# EAGLE schematic ChessMateBattery (EAGLE 9.1.0)
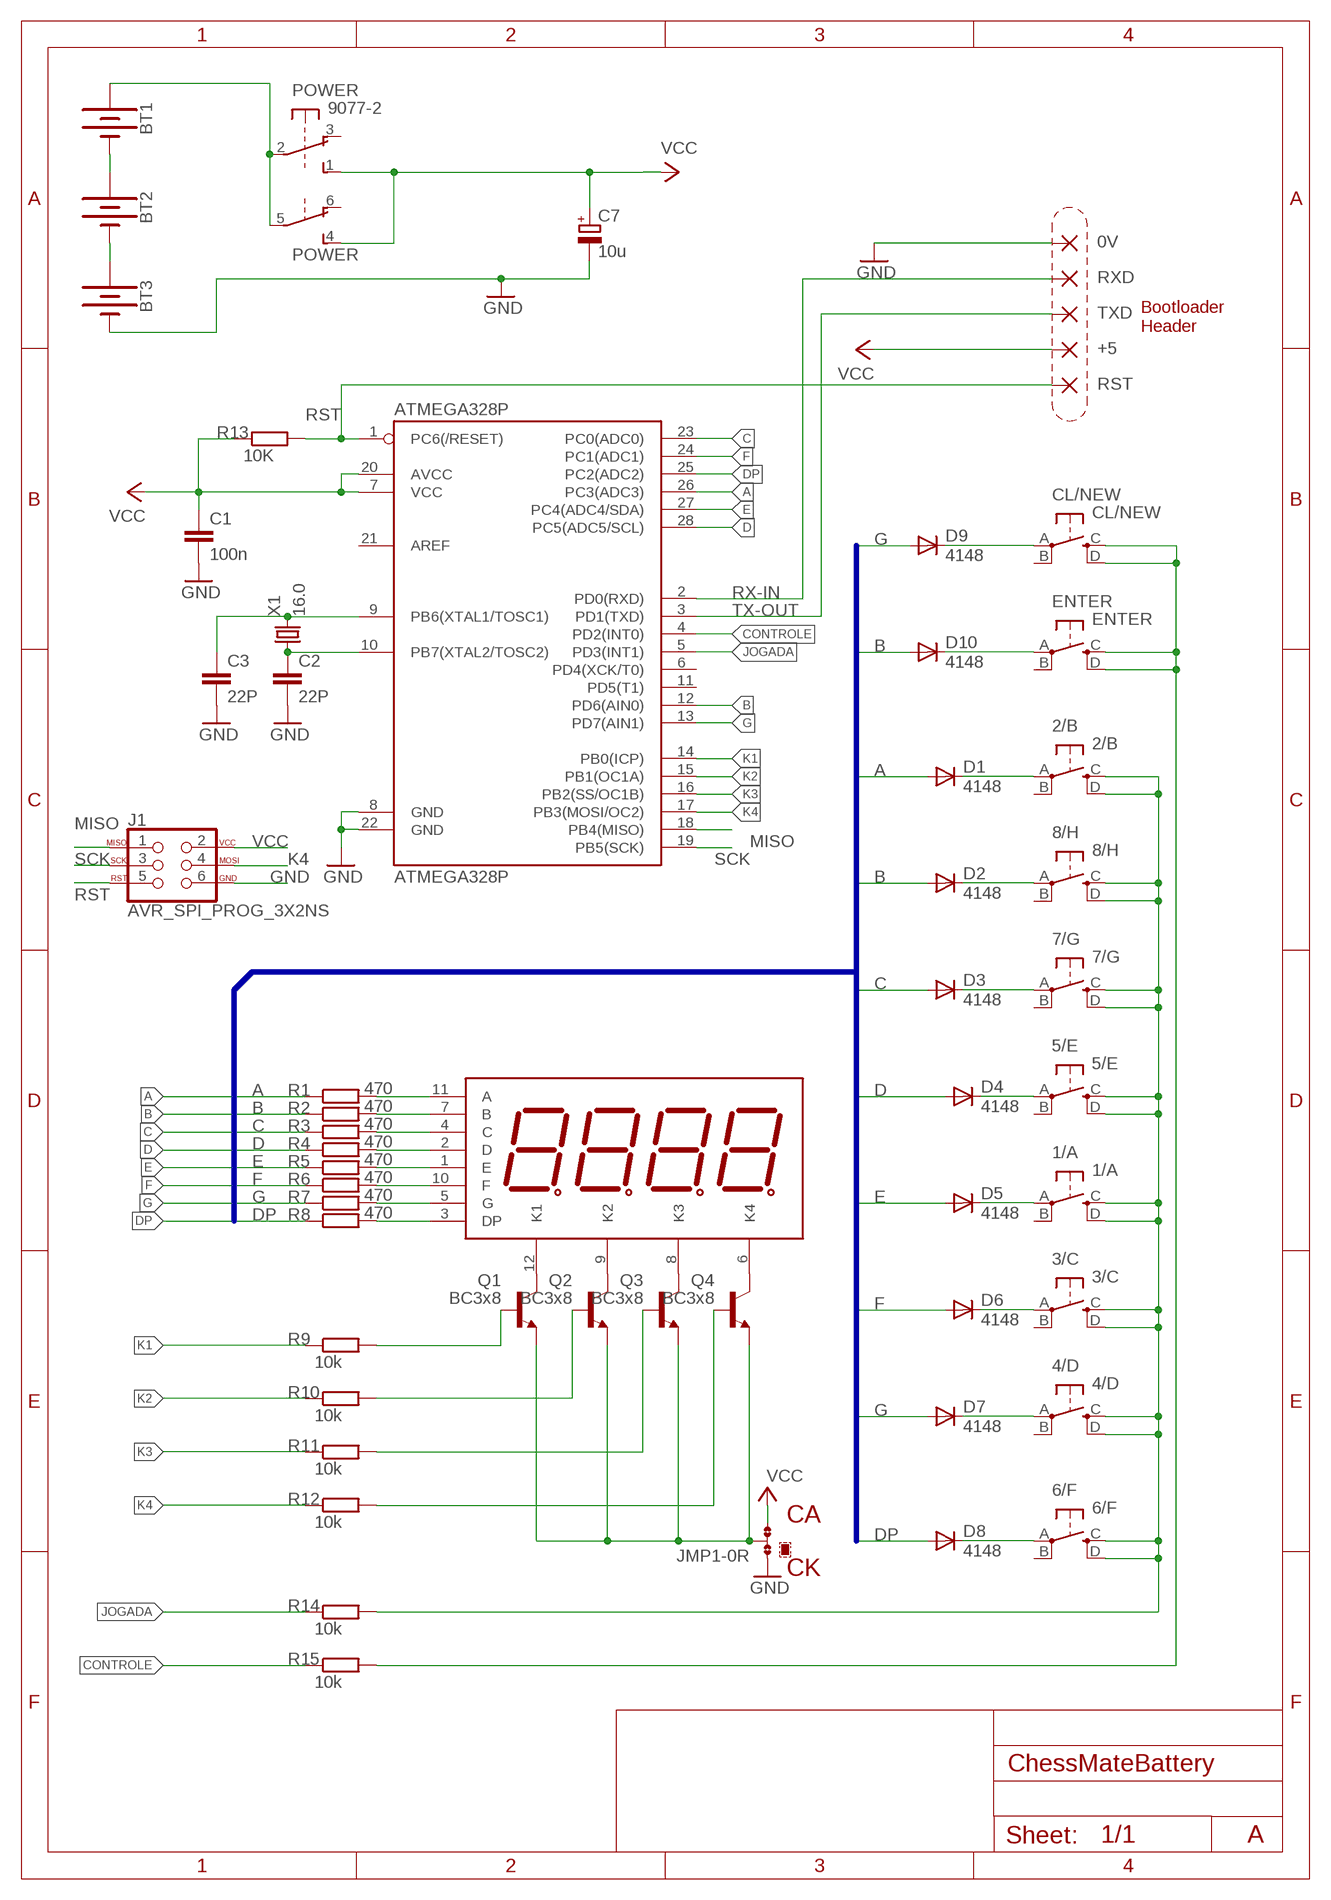
[diagram p0: schematic, sheet 1]

## Parts
0V  2,15/1,0  [2,15/1,0]
1/A  1/A  10-XXTACT  [TACT_SW]
2/B  2/B  10-XXTACT  [TACT_SW]
3/C  3/C  10-XXTACT  [TACT_SW]
4/D  4/D  10-XXTACT  [TACT_SW]
5/E  5/E  10-XXTACT  [TACT_SW]
6/F  6/F  10-XXTACT  [TACT_SW]
7/G  7/G  10-XXTACT  [TACT_SW]
8/H  8/H  10-XXTACT  [TACT_SW]
+5  2,15/1,0  [2,15/1,0]
ATMEGA328P  ATMEGA328P  ATMEGA328P_PDIP  [DIL28-3]
BT1  BATTERY-AAA_KIT  [BATTERY-AAA-KIT]
BT2  BATTERY-AAA_KIT  [BATTERY-AAA-KIT]
BT3  BATTERY-AAA_KIT  [BATTERY-AAA-KIT]
C1  100n  C-EUC050-024X044L  [C050-024X044L]
C2  22P  C-EU  [C025-024X044L]
C3  22P  C-EU  [C025-024X044L]
C7  10u  CPOL-EUTT2D7L  [TT2D7L]
CL/NEW  CL/NEW  10-XXTACT  [TACT_SW]
D1  4148  1N4148DO35-7  [DO35-7]
D2  4148  1N4148DO35-7  [DO35-7]
D3  4148  1N4148DO35-7  [DO35-7]
D4  4148  1N4148DO35-7  [DO35-7]
D5  4148  1N4148DO35-7  [DO35-7]
D6  4148  1N4148DO35-7  [DO35-7]
D7  4148  1N4148DO35-7  [DO35-7]
D8  4148  1N4148DO35-7  [DO35-7]
D9  4148  1N4148DO35-7  [DO35-7]
D10  4148  1N4148DO35-7  [DO35-7]
DISPLAY  4_DIGIT-TOF3461BH-N  [TOF3461BH-N]
ENTER  ENTER  10-XXTACT  [TACT_SW]
J1  AVR_SPI_PROG_3X2NS  [2X3-NS]
JMP1  0R-JUMPA  [A0R-JMP]
POWER  9077-2  [9077-2]
Q1  BC3x8  BC338  [TO92-EBC]
Q2  BC3x8  BC338  [TO92-EBC]
Q3  BC3x8  BC338  [TO92-EBC]
Q4  BC3x8  BC338  [TO92-EBC]
R1  470  R-EU_0204/7L  [0204/7L]
R2  470  R-EU_0204/7L  [0204/7L]
R3  470  R-EU_0204/7L  [0204/7L]
R4  470  R-EU_0204/7L  [0204/7L]
R5  470  R-EU_0204/7L  [0204/7L]
R6  470  R-EU_0204/7L  [0204/7L]
R7  470  R-EU_0204/7L  [0204/7L]
R8  470  R-EU_0204/7L  [0204/7L]
R9  10k  R-EU_0204/7L  [0204/7L]
R10  10k  R-EU_0204/7L  [0204/7L]
R11  10k  R-EU_0204/7L  [0204/7L]
R12  10k  R-EU_0204/7L  [0204/7L]
R13  10K  R-EU_0204/5L  [0204/5L]
R14  10k  R-EU_0204/7L  [0204/7L]
R15  10k  R-EU_0204/7L  [0204/7L]
RST  2,15/1,0  [2,15/1,0]
RXD  2,15/1,0  [2,15/1,0]
TXD  2,15/1,0  [2,15/1,0]
X1  16.0  CRYSTALHC49/SL  [HC49/SL]

## Nets
A: ATMEGA328P.26(PC3(ADC3)) D1.A R1.1
B: ATMEGA328P.12(PD6(AIN0)) D2.A D10.A R2.1
C: ATMEGA328P.23(PC0(ADC0)) D3.A R3.1
CONTROLE: ATMEGA328P.4(PD2(INT0)) R15.1
CONTROLE_: CL/NEW.C(S) CL/NEW.D(S1) ENTER.C(S) ENTER.D(S1) R15.2
D: ATMEGA328P.28(PC5(ADC5/SCL)) D4.A R4.1
DP: ATMEGA328P.25(PC2(ADC2)) D8.A R8.1
E: ATMEGA328P.27(PC4(ADC4/SDA)) D5.A R5.1
F: ATMEGA328P.24(PC1(ADC1)) D6.A R6.1
G: ATMEGA328P.13(PD7(AIN1)) D7.A D9.A R7.1
GND: 0V.1(P) ATMEGA328P.8(GND) ATMEGA328P.22(GND) BT3.GND@1(-) C1.2 C2.2 C3.2 C7.- J1.6 JMP1.1
JOGADA: ATMEGA328P.5(PD3(INT1)) R14.1
JOGADA_C: 1/A.C(S) 1/A.D(S1) 2/B.C(S) 2/B.D(S1) 3/C.C(S) 3/C.D(S1) 4/D.C(S) 4/D.D(S1) 5/E.C(S) 5/E.D(S1) 6/F.C(S) 6/F.D(S1) 7/G.C(S) 7/G.D(S1) 8/H.C(S) 8/H.D(S1) R14.2
K1: ATMEGA328P.14(PB0(ICP)) R9.1
K2: ATMEGA328P.15(PB1(OC1A)) R10.1
K3: ATMEGA328P.16(PB2(SS/OC1B)) R11.1
K4: ATMEGA328P.17(PB3(MOSI/OC2)) J1.4 R12.1
MISO: ATMEGA328P.18(PB4(MISO)) J1.1
N$1: DISPLAY.11(A) R1.2
N$2: DISPLAY.7(B) R2.2
N$3: DISPLAY.4(C) R3.2
N$4: DISPLAY.2(D) R4.2
N$5: DISPLAY.1(E) R5.2
N$6: DISPLAY.10(F) R6.2
N$7: DISPLAY.5(G) R7.2
N$8: DISPLAY.3(DP) R8.2
N$9: Q1.B R9.2
N$10: Q2.B R10.2
N$11: Q3.B R11.2
N$12: Q4.B R12.2
N$13: DISPLAY.12(K1) Q1.C
N$14: DISPLAY.9(K2) Q2.C
N$15: DISPLAY.8(K3) Q3.C
N$16: DISPLAY.6(K4) Q4.C
N$18: ATMEGA328P.9(PB6(XTAL1/TOSC1)) C3.1 X1.2
N$19: ATMEGA328P.10(PB7(XTAL2/TOSC2)) C2.1 X1.1
N$20: BT1.PWR@1(+) POWER.2(1:P) POWER.5(2:P)
N$21: CL/NEW.A(P) D9.C
N$22: D10.C ENTER.A(P)
N$23: 2/B.A(P) D1.C
N$24: 8/H.A(P) D2.C
N$25: 5/E.A(P) D4.C
N$26: 1/A.A(P) D5.C
N$27: 3/C.A(P) D6.C
N$28: 4/D.A(P) D7.C
N$29: 6/F.A(P) D8.C
N$30: 7/G.A(P) D3.C
N$31: BT1.GND@1(-) BT2.PWR@1(+)
N$33: BT2.GND@1(-) BT3.PWR@1(+)
N$42: JMP1.2 Q1.E Q2.E Q3.E Q4.E
RST: ATMEGA328P.1(PC6(/RESET)) J1.5 R13.2 RST.1(P)
RX-IN: ATMEGA328P.2(PD0(RXD)) RXD.1(P)
SCK: ATMEGA328P.19(PB5(SCK)) J1.3
TX-OUT: ATMEGA328P.3(PD1(TXD)) TXD.1(P)
VCC: +5.1(P) ATMEGA328P.7(VCC) ATMEGA328P.20(AVCC) C1.1 C7.+ J1.2 JMP1.3 POWER.1(1:S) POWER.4(2:S) R13.1
Unconnected: 1/A.B(P1) 2/B.B(P1) 3/C.B(P1) 4/D.B(P1) 5/E.B(P1) 6/F.B(P1) 7/G.B(P1) 8/H.B(P1) ATMEGA328P.6(PD4(XCK/T0)) ATMEGA328P.11(PD5(T1)) ATMEGA328P.21(AREF) CL/NEW.B(P1) ENTER.B(P1) POWER.3(1:O) POWER.6(2:O)

## Buses
A,B,C,D,E,F,G,DP

## Notes on the sheet
- Bootloader
  Header
- CA
- CK
- A

## Library data of the parts
0V +5 RST RXD TXD = wirepad:2,15/1,0: THROUGH-HOLE PAD
1/A 2/B 3/C 4/D 5/E 6/F 7/G 8/H CL/NEW ENTER = XessMate:10-XX: OMRON SWITCH
ATMEGA328P = SparkFun-DigitalIC:ATMEGA328P_PDIP: uC used in the Arduino 32kb flash, 1k EEPROM, 2k SRAM This is the through-hole version of this chip.
BT1-BT3 = SparkFun-Batteries:BATTERY: Battery - Single Cell A variety of battery chemistries, sizes, and footprints. Device List: 20MM_PTH - Coin Cell Battery Holder - 20mm (PTH) <https://www.sparkfun.com/products/783> 6.8MM_PTH - Coin Cell Battery Holder - 6.8MM(SMD) <https://www.digikey.com/product-detail/en/seiko-instruments/MS621FE-FL11E/728-1057-ND/1889208?WT.srch=1&gclid=CNOQ5a6LzdQCFZS2wAodXCkE0g> 12MM_SMD - Coin Cell Battery Holder - 12mm (SMD) <https://www.sparkfun.com/products/10592> 12MM_PTH - Coin Cell Battery Holder - 12mm (PTH) <https://www.sparkfun.com/products/7948> 20MM_SMD - 20mm Coin Cell Battery Holder (SMD) (2 legs) Used on the Big Time Watch Kit <https://www.sparkfun.com/products/11734> 20MM_SMD_4LEGS - Coin Cell Battery Holder - 20mm (SMD) <https://www.sparkfun.com/products/11892> 20MM_SMD_4LEGS_OVERPASTE - Coin Cell Battery Holder - 20mm (SMD) <https://www.sparkfun.com/products/11892> (Over-paste on the legs) 24.5MM_PTH - Coin Cell Battery Holder - 24.5mm (PTH) <https://www.sparkfun.com/products/8863> 9V - 9V Battery Holder - PC Mount Used on the SparkFun SparkPunk Sound Kit <https://www.sparkfun.com/products/11177> and SparkFun SparkPunk Sequencer Kit <https://www.sparkfun.com/products/12707> 18650 - Battery Holder - 18650 (PTH) <https://www.sparkfun.com/products/13113> AA - Battery Holder - 1xAA (PTH) <https://www.sparkfun.com/products/7949> AAA - Battery Holder - 1xAAA (PTH) <https://www.sparkfun.com/products/12718> AA_KIT - Battery Holder - 1xAA (PTH) <https://www.sparkfun.com/products/7949> Special kit package - pads only have exposed copper on one side of the board. AAA_KIT - Battery Holder - 1xAAA (PTH) <https://www.sparkfun.com/products/12718> Special kit package - pads only have exposed copper on one side of the board.; PROD_ID: BATT-08571; SF_SKU: PRT-12718
C1-C3 = rcl:C-EU: CAPACITOR, European symbol
C7 = rcl:CPOL-EU: POLARIZED CAPACITOR, European symbol
D1-D10 = XessMate:1N4148: DIODE high speed (Philips)
DISPLAY = 7Segment-Displays:4_DIGIT: The HP QDSP-6064 are 2.79mm (.11"), micro seven segment GaAsP numeric indicators packaged in 4 digits end-stackable clusters.
J1 = SparkFun-Connectors:AVR_SPI_PROG_3X2: AVR ISP 6 Pin This is the reduced ISP connector for AVR programming. Common on Arduino. This footprint will take up less PCB space and can be used with a 10-pin to 6-pin adapter such as SKU: BOB-08508 **Special note about "TEST_POINT" package. The stop mask is on the top side, so if you want your programming test points to be on the bottom of your board, make sure to place this package on the bottom side of the board. This also ensure that the orientation to program from the bottom side will be correct. SparkFun Products: SparkFun ISP Pogo Adapter <https://www.sparkfun.com/products/11591> - NS Tiny AVR Programmer <https://www.sparkfun.com/products/11801> -PTH
JMP1 = jump-0r-smd:0R-JUMP: SMD 0R 0805 Jumper
POWER = switch-misc:9077-2: MARQUARDT SWITCH 9077.0200 Distributor: Buerklin <https://www.buerklin.com/default.asp?event=ShowArtikel%2812G2822%29&l=d&jump=ArtNr_12G2822>
Q1-Q4 = transistor-npn:BC338*: NPN Transistor
R1-R15 = rcl:R-EU_: RESISTOR, European symbol
X1 = crystal:CRYSTAL: CRYSTAL